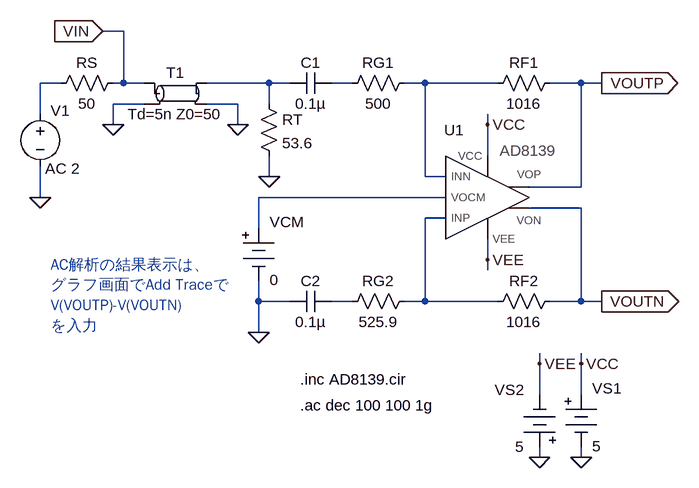
[diagram p0: schematic fig-02-05-23.asc]
fig-02-05-23.asc, the LTspice schematic file:
Version 4
SHEET 1 1332 680
WIRE -208 -208 -240 -208
WIRE -304 -128 -336 -128
WIRE -208 -128 -208 -208
WIRE -208 -128 -224 -128
WIRE -176 -128 -208 -128
WIRE 16 -128 -80 -128
WIRE 48 -128 16 -128
WIRE 144 -128 112 -128
WIRE 256 -128 224 -128
WIRE 368 -128 256 -128
WIRE 496 -128 448 -128
WIRE 528 -128 496 -128
WIRE -176 -96 -224 -96
WIRE -32 -96 -80 -96
WIRE 16 -96 16 -128
WIRE -336 -80 -336 -128
WIRE -224 -64 -224 -96
WIRE -32 -64 -32 -96
WIRE 352 -64 352 -80
WIRE 352 -16 352 -64
WIRE 16 16 16 -16
WIRE 256 16 256 -128
WIRE 288 16 256 16
WIRE 496 32 496 -128
WIRE 496 32 416 32
WIRE -336 48 -336 0
WIRE 288 48 0 48
WIRE 496 64 416 64
WIRE 288 80 256 80
WIRE 0 96 0 48
WIRE 352 144 352 112
WIRE 352 160 352 144
WIRE 0 208 0 176
WIRE 48 208 0 208
WIRE 144 208 112 208
WIRE 256 208 256 80
WIRE 256 208 224 208
WIRE 368 208 256 208
WIRE 496 208 496 64
WIRE 496 208 448 208
WIRE 528 208 496 208
WIRE 0 256 0 208
WIRE 432 304 432 288
WIRE 496 304 496 288
WIRE 432 352 432 304
WIRE 496 352 496 304
WIRE 432 448 432 432
WIRE 496 448 496 432
FLAG -336 48 0
FLAG 528 -128 VOUTP
IOPIN 528 -128 Out
FLAG 0 256 0
FLAG 432 448 0
FLAG 496 448 0
FLAG 432 304 VEE
FLAG 496 304 VCC
FLAG 352 -64 VCC
FLAG 352 144 VEE
FLAG 528 208 VOUTN
IOPIN 528 208 Out
FLAG -224 -64 0
FLAG 16 16 0
FLAG -32 -64 0
FLAG -240 -208 VIN
IOPIN -240 -208 In
SYMBOL res 464 -144 R90
WINDOW 0 0 56 VBottom 2
WINDOW 3 32 56 VTop 2
SYMATTR InstName RF1
SYMATTR Value 1016
SYMBOL res 240 -144 R90
WINDOW 0 0 56 VBottom 2
WINDOW 3 32 56 VTop 2
SYMATTR InstName RG1
SYMATTR Value 500
SYMBOL voltage -336 -96 R0
WINDOW 0 31 26 Bottom 2
WINDOW 3 108 110 Bottom 2
WINDOW 123 34 115 Bottom 2
WINDOW 39 0 0 Left 0
SYMATTR InstName V1
SYMATTR Value ""
SYMATTR Value2 AC 2
SYMBOL Misc\\battery 496 336 R0
WINDOW 0 17 6 Left 2
WINDOW 3 17 95 Left 2
WINDOW 123 0 0 Left 0
WINDOW 39 0 0 Left 0
SYMATTR InstName VS1
SYMATTR Value 5
SYMBOL Misc\\battery 432 448 R180
WINDOW 0 24 104 Left 2
WINDOW 3 24 16 Left 2
WINDOW 123 0 0 Left 0
WINDOW 39 0 0 Left 0
SYMATTR InstName VS2
SYMATTR Value 5
SYMBOL AD8139-sub 352 48 R0
WINDOW 0 -51 -88 Bottom 2
SYMATTR InstName U1
SYMATTR Value AD8139
SYMATTR Prefix X
SYMBOL res 464 192 R90
WINDOW 0 0 56 VBottom 2
WINDOW 3 32 56 VTop 2
SYMATTR InstName RF2
SYMATTR Value 1016
SYMBOL res 240 192 R90
WINDOW 0 0 56 VBottom 2
WINDOW 3 32 56 VTop 2
SYMATTR InstName RG2
SYMATTR Value 525.9
SYMBOL Misc\\battery 0 80 R0
WINDOW 0 17 6 Left 2
WINDOW 3 17 95 Left 2
WINDOW 123 0 0 Left 0
WINDOW 39 0 0 Left 0
SYMATTR InstName VCM
SYMATTR Value 0
SYMBOL tline -128 -112 R0
SYMATTR InstName T1
SYMATTR Value Td=5n Z0=50
SYMBOL res -208 -144 R90
WINDOW 0 0 56 VBottom 2
WINDOW 3 32 56 VTop 2
SYMATTR InstName RS
SYMATTR Value 50
SYMBOL res 0 -112 R0
SYMATTR InstName RT
SYMATTR Value 53.6
SYMBOL cap 112 -144 R90
WINDOW 0 0 32 VBottom 2
WINDOW 3 32 32 VTop 2
SYMATTR InstName C1
SYMATTR Value 0.1µ
SYMBOL cap 112 192 R90
WINDOW 0 0 32 VBottom 2
WINDOW 3 32 32 VTop 2
SYMATTR InstName C2
SYMATTR Value 0.1µ
TEXT 64 328 Left 2 !.inc AD8139.cir
TEXT 64 368 Left 2 !.ac dec 100 100 1g
TEXT -320 152 Left 2 ;AC解析の結果表示は、\nグラフ画面でAdd Traceで\nV(VOUTP)-V(VOUTN)\nを入力

The netlist it stands for:
* fig-02-05-23.asc
RF1 VOUTP N004 1016
RG1 N004 N003 500
V1 N001 0 AC 2
VS1 VCC 0 5
VS2 0 VEE 5
XU1 N004 N005 VCC VOUTP VOUTN VEE N006 AD8139-sub params: AD8139  ; pins INN VOCM VCC VOP VON VEE INP
RF2 VOUTN N006 1016
RG2 N006 N007 525.9
VCM N005 0 0
T1 VIN 0 N002 0 Td=5n Z0=50
RS VIN N001 50
RT N002 0 53.6
C1 N003 N002 0.1µ
C2 N007 0 0.1µ
.inc AD8139.cir
.ac dec 100 100 1g
* AC解析の結果表示は、
* グラフ画面でAdd Traceで
* V(VOUTP)-V(VOUTN)
* を入力
.backanno
.end